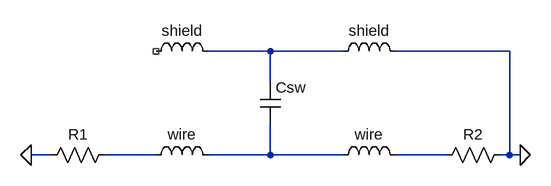
[diagram p0: schematic sch_B.asc]
sch_B.asc, the LTspice schematic file:
Version 4
SHEET 1 880 680
WIRE 0 0 -96 0
WIRE 112 0 0 0
WIRE 368 0 192 0
WIRE 0 48 0 0
WIRE -336 160 -368 160
WIRE -176 160 -256 160
WIRE 0 160 0 112
WIRE 0 160 -96 160
WIRE 112 160 0 160
WIRE 272 160 192 160
WIRE 368 160 368 0
WIRE 368 160 352 160
WIRE 384 160 368 160
FLAG -368 160 0
FLAG 384 160 0
SYMBOL cap -16 48 R0
SYMATTR InstName Csw
SYMATTR Value ""
SYMBOL ind -192 16 R270
WINDOW 0 32 56 VTop 2
WINDOW 3 5 56 VBottom 2
SYMATTR InstName shield
SYMATTR Value ""
SYMBOL res -240 144 R90
WINDOW 0 0 56 VBottom 2
WINDOW 3 32 56 VTop 2
SYMATTR InstName R1
SYMATTR Value ""
SYMBOL ind 96 16 R270
WINDOW 0 32 56 VTop 2
WINDOW 3 5 56 VBottom 2
SYMATTR InstName shield
SYMATTR Value ""
SYMBOL ind -192 176 R270
WINDOW 0 32 56 VTop 2
WINDOW 3 5 56 VBottom 2
SYMATTR InstName wire
SYMATTR Value ""
SYMBOL ind 96 176 R270
WINDOW 0 32 56 VTop 2
WINDOW 3 5 56 VBottom 2
SYMATTR InstName wire
SYMATTR Value ""
SYMBOL res 368 144 R90
WINDOW 0 0 56 VBottom 2
WINDOW 3 32 56 VTop 2
SYMATTR InstName R2
SYMATTR Value ""

The netlist it stands for:
* sch_B.asc
Csw N001 N003
L§shield NC_01 N001
R1 N002 0
L§shield N001 0
L§wire N002 N003
L§wire N003 N004
R2 0 N004
.backanno
.end